# Altium project rocket.PrjPcb
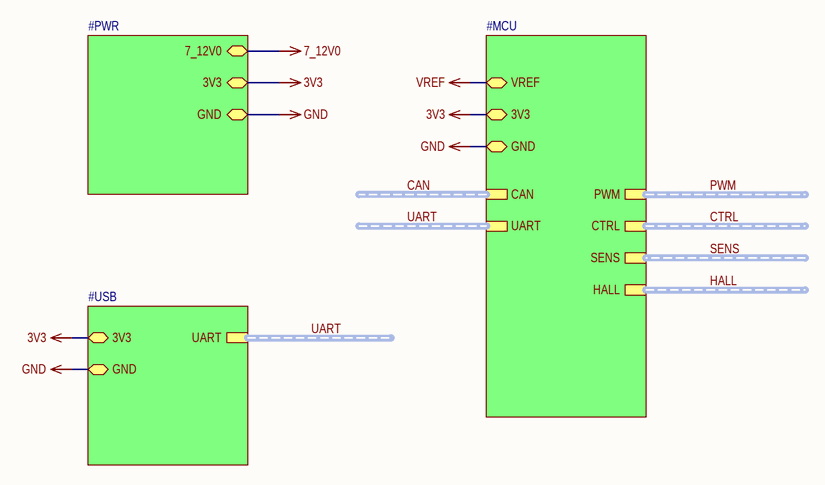
[diagram p0: rocket.SchDoc]
4 sheets, 36 parts. Net scope: hierarchical (ports join the sheet entries above them; power ports are global).
Sheets:
  rocket.SchDoc
    #PWR = power.SchDoc
    #USB = usb.SchDoc
    #MCU = mcu.SchDoc

## Sheet rocket.SchDoc: Наименование
size 420 x 297 mm; ApprovedBy: Утвердил; CheckedBy: Проверил; Author: Разработал; CompanyName: ВлГУ; DrawnBy: Н.Контр; Engineer: Т.Контр; SheetNumber: 1; SheetTotal: 4; PageSetup: Record=PageOptions|CenterHorizontal=True|CenterVertical=True|PrintScale=0.94|XCorrection=1.00|YCorrection=1.00|PrintKind=1|BorderSize=5000000|LeftOffset=0|BottomOffset=0|Orientation=1|PaperLength=1000|PaperWidth=1000|Scale=100|PaperSource=7|PrintQuality=-4|MediaType=1|DitherType=10|PaperKind=A4|PrintScaleMode=1; HeadOfSector: Нач. сектора; MainDevice: Перв.примен.; Name: Наименование; DocumentName: Sheet1.SCHDOC

### Sub-sheets
#MCU = mcu.SchDoc: GND (bidir), 3V3 (bidir), CAN (harness CAN), UART (harness UART), CTRL (harness CTRL), VREF (bidir), SENS (harness SENS), HALL (harness HALL), PWM (harness PWM)
#PWR = power.SchDoc: 3V3 (bidir), GND (bidir), 7_12V0 (bidir)
#USB = usb.SchDoc: 3V3 (bidir), GND (bidir), UART (harness UART)

### Nets
3V3: sheet #PWR/3V3, sheet #USB/3V3, sheet #MCU/3V3
7_12V0: sheet #PWR/7_12V0
GND: sheet #PWR/GND, sheet #USB/GND, sheet #MCU/GND

### Buses and harness runs
harness CAN = sheet #MCU/CAN
harness CTRL = sheet #MCU/CTRL
harness HALL = sheet #MCU/HALL
harness PWM = sheet #MCU/PWM
harness SENS = sheet #MCU/SENS
harness UART = sheet #MCU/UART
harness UART = sheet #USB/UART

### Notes on the sheet
- Подп. и дата
- Инв.№ дубл.
- Взам.инв.№
- Подп.и дата
- Инв.№ подл.
- Изм.
- Лист
- № докум.
- Подп.
- Дата
- Формат  A3

## Sheet power.SchDoc
size A3; SheetNumber: 2; SheetTotal: 2

## Sheet usb.SchDoc: Наименование
size 209 x 297 mm; ApprovedBy: Утвердил; CheckedBy: Проверил; Author: Разработал; CompanyName: ВлГУ; DrawnBy: Н.Контр; Engineer: Т.Контр; SheetNumber: 1; SheetTotal: 1; PageSetup: Record=PageOptions|CenterHorizontal=True|CenterVertical=True|PrintScale=0.94|XCorrection=1.00|YCorrection=1.00|PrintKind=1|BorderSize=5000000|LeftOffset=0|BottomOffset=0|Orientation=1|PaperLength=1000|PaperWidth=1000|Scale=100|PaperSource=7|PrintQuality=-4|MediaType=1|DitherType=10|PaperKind=A4|PrintScaleMode=1; DecimalNumber: Децимальный номер; HeadOfSector: Нач. сектора; MainDevice: Перв.примен.; Name: Наименование; DocumentName: Sheet1.SCHDOC
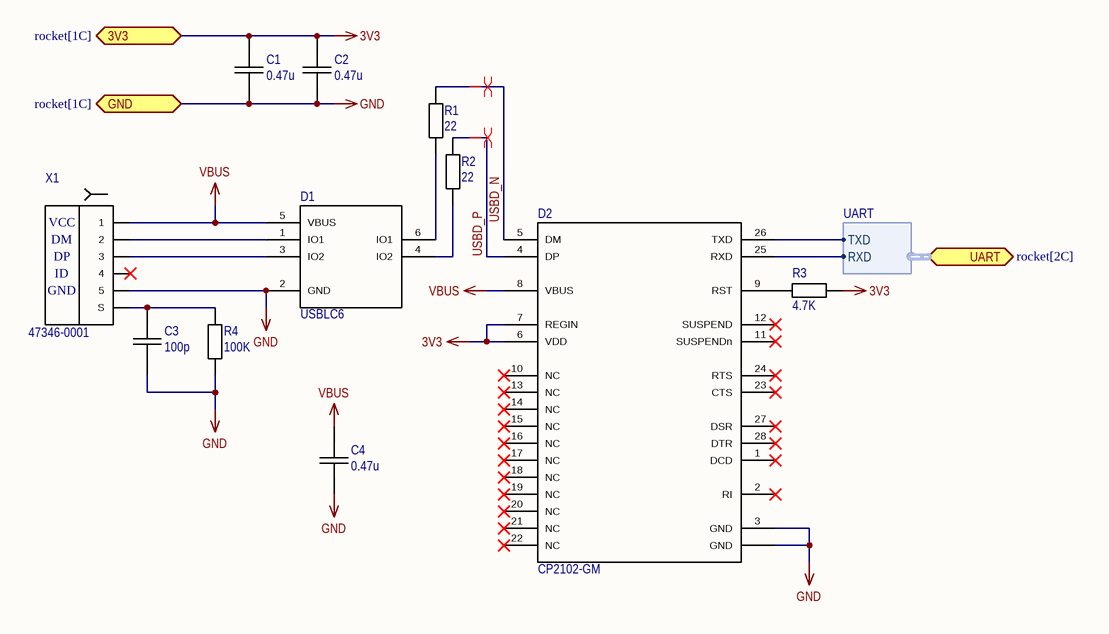
[diagram p1: usb.SchDoc]

### Parts
C1  value 0.47u  [CAP-0402]  (hidden comment: CAP-0.47u-10%-50V-X7R-0402)
C2  value 0.47u  [CAP-0402]  (hidden comment: CAP-0.47u-10%-50V-X7R-0402)
C3  value 100p  [CAP-0805]  (hidden comment: CAP-100p-10%-100V-COG-0805)
C4  value 0.47u  [CAP-0402]  (hidden comment: CAP-0.47u-10%-50V-X7R-0402)
D1  USBLC6  [SOT-23-6]
D2  CP2102-GM  [QFN-28-5x5]
R1  value 22  [RES-0402]  (hidden comment: RES-22-1%-0.063-0402)
R2  value 22  [RES-0402]  (hidden comment: RES-22-1%-0.063-0402)
R3  value 4.7K  [RES-0402]  (hidden comment: RES-4.7K-1%-0.063-0402)
R4  value 100K  [RES-0402]  (hidden comment: RES-100K-1%-0.063-0402)
X1  47346-0001  [473460001]

### Ports
3V3 (bidir, see rocket[1C]), GND (bidir, see rocket[1C]), UART (bidir, harness UART, see rocket[2C])

### Harnesses
UART: TXD, RXD

### Nets
3V3: C1.2 C2.2 D2.6(VDD) D2.7(REGIN) R3.1 ; port 3V3
GND: C1.1 C2.1 C3.1 C4.1 D1.2(GND) D2.3(GND) D2.PAD(GND) R4.1 X1.5 ; port GND
VBUS: C4.2 D1.5(VBUS) D2.8(VBUS) X1.1
UART.RXD: D2.25(RXD) ; port UART.RXD
UART.TXD: D2.26(TXD) ; port UART.TXD
USBD_N: D2.5(DM) R1.2
USBD_P: D2.4(DP) R2.2
NetC3_2: C3.2 R4.2 X1.SHIELD(S)
NetD1_1: D1.1(IO1) X1.2
NetD1_3: D1.3(IO2) X1.3
NetD1_4: D1.4(IO2) R2.1
NetD1_6: D1.6(IO1) R1.1
NetD2_9: D2.9(RST) R3.2

Not connected (* = marked no-connect by the designer): D2 1(DCD)* 2(RI)* 10(NC)* 11(SUSPENDn)* 12(SUSPEND)* 13(NC)* 14(NC)* 15(NC)* 16(NC)* 17(NC)* 18(NC)* 19(NC)* 20(NC)* 21(NC)* 22(NC)* 23(CTS)* 24(RTS)* 27(DSR)* 28(DTR)*; X1 4*

### Layout directives
differential pair: USBD_N, USBD_P

### Notes on the sheet
- Подп. и дата
- Инв.№ дубл.
- Взам.инв.№
- Подп.и дата
- Инв.№ подл.
- Изм.
- Лист
- № докум.
- Подп.
- Дата
- Формат  A4
- (in symbol USB-Micro-B) VCC; DM; DP; ID; GND

### Library data of the parts
C1 C2 C4 = CAP-0402: Конденсатор; Tolerance: 10; Voltage: 50; Part Number: *; Manufacturer: *; Temperature: X7R
C3 = CAP-0805: Конденсатор; Tolerance: 10; Voltage: 100; Part Number: *; Manufacturer: *; Temperature: COG
D1 = USBLC6: Интегральная микросхема; Manufacturer: TI; Part Number: USBLC6
D2 = CP2102: Интегральная микросхема; Manufacturer: SiLabs; Part Number: CP2102-GM
R1-R4 = RES-0402: Резистор; Tolerance: 1; Power: 0.063; Part Number: *; Manufacturer: *
X1 = USB-Micro-B: Manufacturer: Molex; Part Number: 47346-0001

## Sheet mcu.SchDoc
size 420 x 297 mm; SheetNumber: 4; SheetTotal: 4
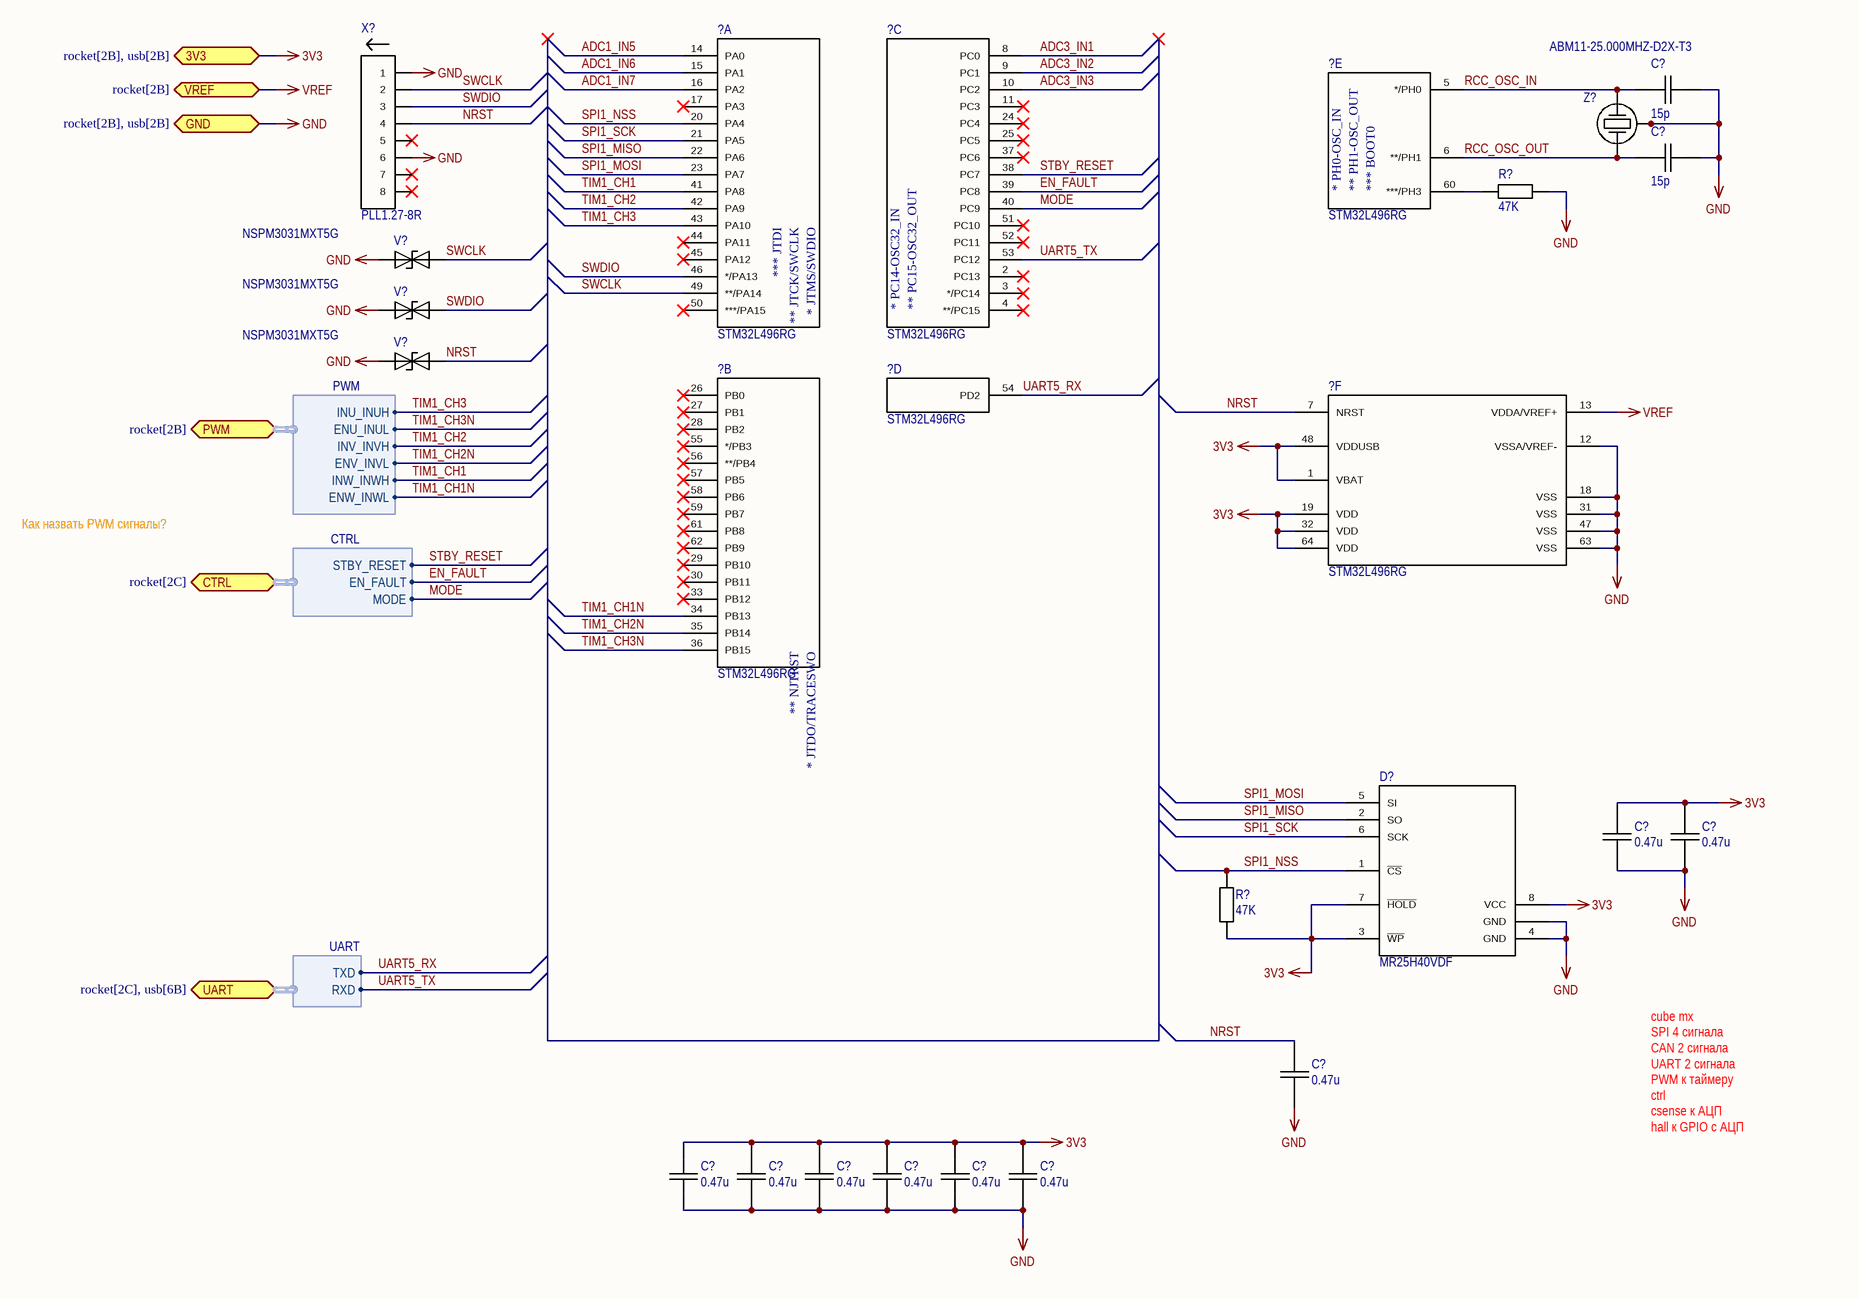
[diagram p2: mcu.SchDoc]

### Parts
(Parts that share a designator on the sheet are numbered #1, #2 ... from top to bottom, then left to right.)
?#1  STM32L496RG  [LQFP64]  (part A of 6)
?#2  STM32L496RG  [LQFP64]  (part C of 6)
?#3  STM32L496RG  [LQFP64]  (part E of 6)
?#4  STM32L496RG  [LQFP64]  (part B of 6)
?#5  STM32L496RG  [LQFP64]  (part D of 6)
?#6  STM32L496RG  [LQFP64]  (part F of 6)
C?#1  value 15p  [CAP-0402]  (hidden comment: CAP-1000p-5%-50V-NP0-0402)
C?#2  value 15p  [CAP-0402]  (hidden comment: CAP-1000p-5%-50V-NP0-0402)
C?#3  value 0.47u  [CAP-0402]  (hidden comment: CAP-0.47u-10%-50V-X7R-0402)
C?#4  value 0.47u  [CAP-0402]  (hidden comment: CAP-0.47u-10%-50V-X7R-0402)
C?#5  value 0.47u  [CAP-0402]  (hidden comment: CAP-0.47u-10%-50V-X7R-0402)
C?#6  value 0.47u  [CAP-0402]  (hidden comment: CAP-0.47u-10%-50V-X7R-0402)
C?#7  value 0.47u  [CAP-0402]  (hidden comment: CAP-0.47u-10%-50V-X7R-0402)
C?#8  value 0.47u  [CAP-0402]  (hidden comment: CAP-0.47u-10%-50V-X7R-0402)
C?#9  value 0.47u  [CAP-0402]  (hidden comment: CAP-0.47u-10%-50V-X7R-0402)
C?#10  value 0.47u  [CAP-0402]  (hidden comment: CAP-0.47u-10%-50V-X7R-0402)
C?#11  value 0.47u  [CAP-0402]  (hidden comment: CAP-0.47u-10%-50V-X7R-0402)
D?  MR25H40VDF  [DFN-8-5x6-SMALL_FLAG - duplicate]
R?#1  value 47K  [RES-0402]  (hidden comment: RES-47K-1%-0.063-0402)
R?#2  value 47K  [RES-0402]  (hidden comment: RES-47K-1%-0.063-0402)
V?#1  NSPM3031MXT5G  [X2DFN-2]
V?#2  NSPM3031MXT5G  [X2DFN-2]
V?#3  NSPM3031MXT5G  [X2DFN-2]
X?  PLL1.27-8R  [PLL1.27-8R]
Z?  ABM11-25.000MHZ-D2X-T3  [ABM11]

### Ports
3V3 (bidir, see rocket[2B], usb[2B]), CTRL (bidir, harness CTRL, see rocket[2C]), GND (bidir, see rocket[2B], usb[2B]), PWM (bidir, harness PWM, see rocket[2B]), UART (bidir, harness UART, see rocket[2C], usb[6B]), VREF (bidir, see rocket[2B])

### Harnesses
PWM: INU_INUH, ENU_INUL, INV_INVH, ENV_INVL, INW_INWH, ENW_INWL
CTRL: STBY_RESET, EN_FAULT, MODE
UART: TXD, RXD

### Nets
3V3: ?#6.1(VBAT) ?#6.19(VDD) ?#6.32(VDD) ?#6.48(VDDUSB) ?#6.64(VDD) C?#3.2 C?#4.2 C?#6.2 C?#7.2 C?#8.2 C?#9.2 C?#10.2 C?#11.2 D?.3(~{WP}) D?.7(~{HOLD}) D?.8(VCC) R?#2.1 ; port 3V3
GND: ?#6.12(VSSA/VREF-) ?#6.18(VSS) ?#6.31(VSS) ?#6.47(VSS) ?#6.63(VSS) C?#1.2 C?#2.2 C?#3.1 C?#4.1 C?#5.1 C?#6.1 C?#7.1 C?#8.1 C?#9.1 C?#10.1 C?#11.1 D?.4(GND) D?.PAD(GND) R?#1.2 V?#1.1 V?#2.1 V?#3.1 X?.1 X?.6 Z?.2 Z?.4 ; port GND
VREF: ?#6.13(VDDA/VREF+) ; port VREF
ADC1_IN5: ?#1.14(PA0)
ADC1_IN6: ?#1.15(PA1)
ADC1_IN7: ?#1.16(PA2)
ADC3_IN1: ?#2.8(PC0)
ADC3_IN2: ?#2.9(PC1)
ADC3_IN3: ?#2.10(PC2)
EN_FAULT: ?#2.39(PC8) ; port CTRL.EN_FAULT  [project net CTRL.EN_FAULT]
MODE: ?#2.40(PC9) ; port CTRL.MODE  [project net CTRL.MODE]
NRST: ?#6.7(NRST) C?#5.2 V?#3.2 X?.4
RCC_OSC_IN: ?#3.5(*/PH0) C?#1.1 Z?.3
RCC_OSC_OUT: ?#3.6(**/PH1) C?#2.1 Z?.1
SPI1_MISO: ?#1.22(PA6) D?.2(SO)
SPI1_MOSI: ?#1.23(PA7) D?.5(SI)
SPI1_NSS: ?#1.20(PA4) D?.1(~{CS}) R?#2.2
SPI1_SCK: ?#1.21(PA5) D?.6(SCK)
STBY_RESET: ?#2.38(PC7) ; port CTRL.STBY_RESET  [project net CTRL.STBY_RESET]
SWCLK: ?#1.49(**/PA14) V?#1.2 X?.2
SWDIO: ?#1.46(*/PA13) V?#2.2 X?.3
TIM1_CH1: ?#1.41(PA8) ; port PWM.INW_INWH  [project net PWM.INW_INWH]
TIM1_CH1N: ?#4.34(PB13) ; port PWM.ENW_INWL  [project net PWM.ENW_INWL]
TIM1_CH2: ?#1.42(PA9) ; port PWM.INV_INVH  [project net PWM.INV_INVH]
TIM1_CH2N: ?#4.35(PB14) ; port PWM.ENV_INVL  [project net PWM.ENV_INVL]
TIM1_CH3: ?#1.43(PA10) ; port PWM.INU_INUH  [project net PWM.INU_INUH]
TIM1_CH3N: ?#4.36(PB15) ; port PWM.ENU_INUL  [project net PWM.ENU_INUL]
UART5_RX: ?#5.54(PD2) ; port UART.TXD  [project net UART.TXD]
UART5_TX: ?#2.53(PC12) ; port UART.RXD  [project net UART.RXD]
Net?#3_60: ?#3.60(***/PH3) R?#1.1

Not connected (* = marked no-connect by the designer): ?#1 17(PA3)* 44(PA11)* 45(PA12)* 50(***/PA15)*; ?#2 2(PC13)* 3(*/PC14)* 4(**/PC15)* 11(PC3)* 24(PC4)* 25(PC5)* 37(PC6)* 51(PC10)* 52(PC11)*; ?#4 26(PB0)* 27(PB1)* 28(PB2)* 29(PB10)* 30(PB11)* 33(PB12)* 55(*/PB3)* 56(**/PB4)* 57(PB5)* 58(PB6)* 59(PB7)* 61(PB8)* 62(PB9)*; X? 5* 7* 8*

### Notes on the sheet
- Как назвать PWM сигналы?
- cube mx
  SPI 4 сигнала
  CAN 2 сигнала
  UART 2 сигнала
  PWM к таймеру
  ctrl
  csense к АЦП
  hall к GPIO с АЦП
- Подп. и дата
- Инв.№ дубл.
- Взам.инв.№
- Подп.и дата
- Инв.№ подл.
- Изм.
- Лист
- № докум.
- Подп.
- Дата
- Формат  A3
- (in symbol STM32L496RG, part A) *** JTDI; ** JTCK/SWCLK; * JTMS/SWDIO
- (in symbol STM32L496RG, part B) ** NJTRST; * JTDO/TRACESWO
- (in symbol STM32L496RG, part C) * PC14-OSC32_IN; ** PC15-OSC32_OUT
- (in symbol STM32L496RG, part E) * PH0-OSC_IN; ** PH1-OSC_OUT; *** BOOT0

### Library data of the parts
?#1-?#6 = STM32L496RG: Интегральная микросхема; Manufacturer: ST; Part Number: STM32L496RG
C?#1 C?#2 = CAP-0603: Конденсатор; Tolerance: 5; Voltage: 50; Part Number: *; Manufacturer: *; Temperature: NPO
C?#3-C?#11 = CAP-0402: Конденсатор; Tolerance: 10; Voltage: 50; Part Number: *; Manufacturer: *; Temperature: X7R
D? = MR25H40: Интегральная микросхема, SPI MRAM; Manufacturer: Everspin; Part Number: MR25H40VDF
R?#1 R?#2 = RES-0402: Резистор; Tolerance: 1; Power: 0.063; Part Number: *; Manufacturer: *
V?#1-V?#3 = NSPM3031: Диод подавления ESD; Manufacturer: *; Tolerance: *; Power: *; Part Number: NSPM3031MXT5G
Z? = ABM11-25MHZ: Резонатор кварцевый; Value: *; Manufacturer: *; Tolerance: *; Part Number: ABM11-25.000MHZ-D2X-T3
X? = PLL1.27-8R: Manufacturer: *; Part Number: PLL1.27-8R

## Nets that join several sheets
3V3: usb (5 pins), mcu (17 pins)
GND: usb (9 pins), mcu (26 pins)
UART.RXD: usb (D2.25), mcu (?#2.53)
UART.TXD: usb (D2.26), mcu (?#5.54)